# EAGLE design BrewBoard (EAGLE 9.6.2)
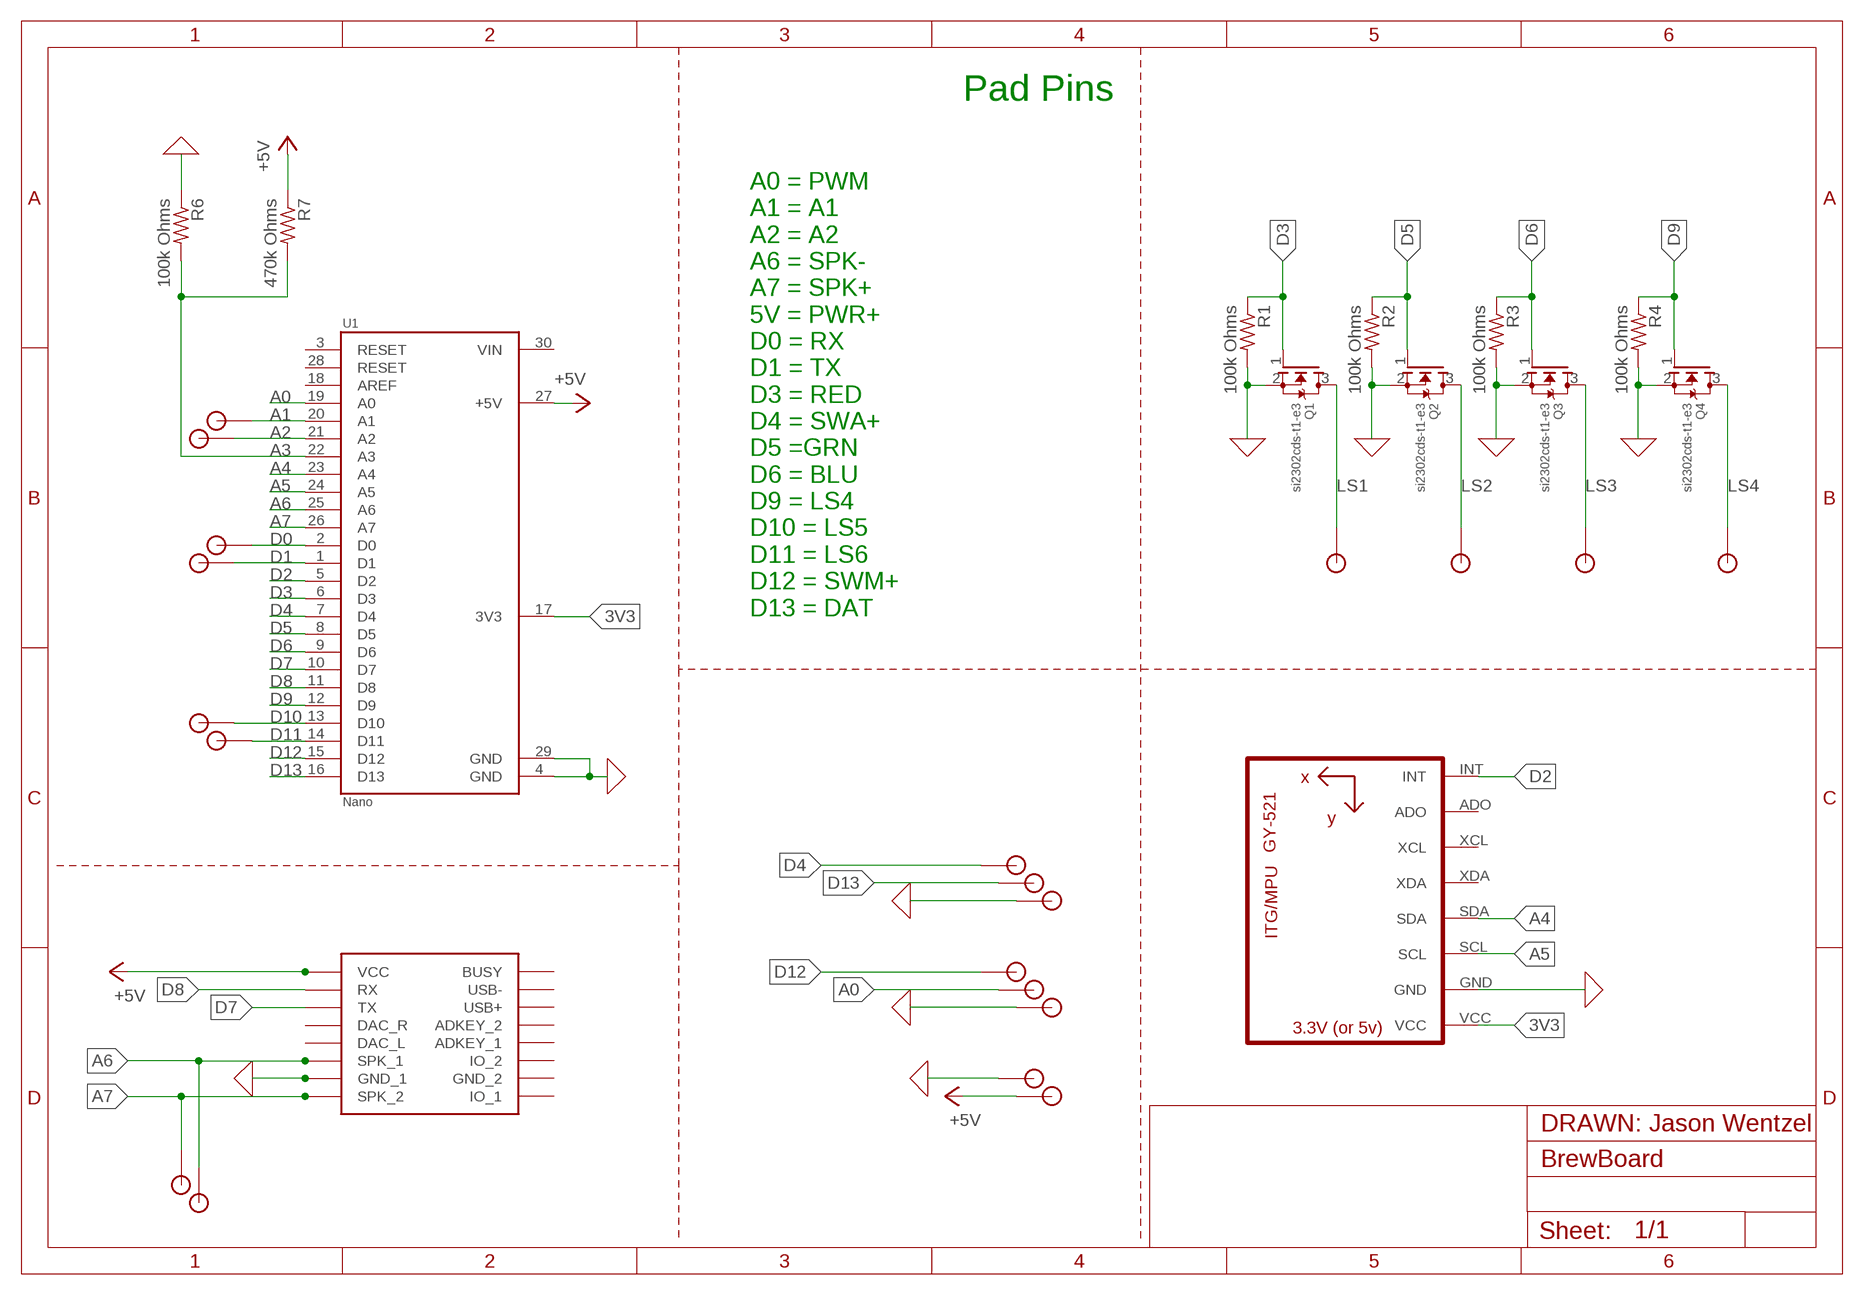
[diagram p0: schematic, sheet 1]

## Parts
LS1  SINGLE_ONE_SIDE_PAD  [SOS_PAD]
Q1  si2302cds-t1-e3  MOSFET-NREFLOW  [SOT23]
Q2  si2302cds-t1-e3  MOSFET-NREFLOW  [SOT23]
Q3  si2302cds-t1-e3  MOSFET-NREFLOW  [SOT23]
Q4  si2302cds-t1-e3  MOSFET-NREFLOW  [SOT23]
R1  100k Ohms  R-US_R0805  [R0805]
R2  100k Ohms  R-US_R0805  [R0805]
R3  100k Ohms  R-US_R0805  [R0805]
R4  100k Ohms  R-US_R0805  [R0805]
R6  100k Ohms  R-US_R0805  [R0805]
R7  470k Ohms  R-US_R0805  [R0805]
SPK+  SINGLE_ONE_SIDE_PAD  [SOS_PAD]
U1  Nano  A000005NANO_SLIM  [ARDUINO_NANO_OUT]
U2  GY-521MPU6050  [GY-521]
U3  DFPLAYER  [DFPLAYER]
U$1  SINGLE_ONE_SIDE_PAD  [SOS_PAD]
U$4  SINGLE_ONE_SIDE_PAD  [SOS_PAD]
U$5  SINGLE_ONE_SIDE_PAD  [SOS_PAD]
U$6  SINGLE_ONE_SIDE_PAD  [SOS_PAD]
U$7  SINGLE_ONE_SIDE_PAD  [SOS_PAD]
U$8  SINGLE_ONE_SIDE_PAD  [SOS_PAD]
U$9  SINGLE_ONE_SIDE_PAD  [SOS_PAD]
U$11  SINGLE_ONE_SIDE_PAD  [SOS_PAD]
U$12  SINGLE_ONE_SIDE_PAD  [SOS_PAD]
U$13  SINGLE_ONE_SIDE_PAD  [SOS_PAD]
U$15  SINGLE_ONE_SIDE_PAD  [SOS_PAD]
U$16  SINGLE_ONE_SIDE_PAD  [SOS_PAD]
U$17  SINGLE_ONE_SIDE_PAD  [SOS_PAD]
U$18  SINGLE_ONE_SIDE_PAD  [SOS_PAD]
U$19  SINGLE_ONE_SIDE_PAD  [SOS_PAD]
U$22  SINGLE_ONE_SIDE_PAD  [SOS_PAD]
U$27  SINGLE_ONE_SIDE_PAD  [SOS_PAD]
U$28  SINGLE_ONE_SIDE_PAD  [SOS_PAD]

## Nets
0: Q1.2(S) Q2.2(S) Q3.2(S) Q4.2(S) R1.2 R2.2 R3.2 R4.2 R6.1 U1.4(GND) U1.29(GND) U2.GND U3.GND_1 U$13.P$1 U$17.P$1 U$27.P$1 ; supply symbol labelled GND
3V3: U1.17(3V3) U2.VCC
+5V: R7.1 U1.27(+5V) U3.VCC U$12.P$1
A0: U1.19(A0) U$18.P$1
A1: U1.20(A1) U$1.P$1
A2: U1.21(A2) U$4.P$1
A3: R6.2 R7.2 U1.22(A3)
A4: U1.23(A4) U2.SDA
A5: U1.24(A5) U2.SCL
A6: U1.25(A6) U3.SPK1(SPK_1) U$11.P$1
A7: SPK+.P$1 U1.26(A7) U3.SPK2(SPK_2)
D0: U1.2(D0) U$5.P$1
D1: U1.1(D1) U$6.P$1
D2: U1.5(D2) U2.INT
D3: Q1.1(G) R1.1 U1.6(D3)
D4: U1.7(D4) U$22.P$1
D5: Q2.1(G) R2.1 U1.8(D5)
D6: Q3.1(G) R3.1 U1.9(D6)
D7: U1.10(D7) U3.TX
D8: U1.11(D8) U3.RX
D9: Q4.1(G) R4.1 U1.12(D9)
D10: U1.13(D10) U$8.P$1
D11: U1.14(D11) U$9.P$1
D12: U1.15(D12) U$19.P$1
D13: U1.16(D13) U$28.P$1
LS1: LS1.P$1 Q1.3(D)
LS2: Q2.3(D) U$15.P$1
LS3: Q3.3(D) U$16.P$1
LS4: Q4.3(D) U$7.P$1
Unconnected: U1.3(RESET) U1.18(AREF) U1.28(RESET) U2.ADO U2.XCL U2.XDA U3.ADKEY1(ADKEY_1) U3.ADKEY2(ADKEY_2) U3.BUSY U3.DAC_L U3.DAC_R U3.GND_2 U3.IO1(IO_1) U3.IO2(IO_2) U3.USB+ U3.USB-

## Notes on the sheet
- Nano | Pad Pins | MOSFETs
- A0 = PWM
  A1 = A1
  A2 = A2
  A6 = SPK-
  A7 = SPK+
  5V = PWR+
  D0 = RX
  D1 = TX
  D3 = RED
  D4 = SWA+
  D5 =GRN
  D6 = BLU
  D9 = LS4
  D10 = LS5
  D11 = LS6
  D12 = SWM+
  D13 = DAT
- Pads | MPU6050
- DFPlayer
- DRAWN: Jason Wentzel

## Power pins joined to a net without a drawn wire
VIN: U1.30(VIN)

## Library data of the parts
LS1 SPK+ U$1 U$4-U$9 U$11-U$13 U$15-U$19 U$22 U$27 U$28 = BrewboardV4:SINGLE_ONE_SIDE_PAD: Small Pad to replace thought hole pads
Q1-Q4 = BrewBoard:MOSFET-N: N-Channel Mosfet 2N7002E - 60V 260mA SOT23 [Digikey: 2N7002ET1GOSTR-ND] - REEL BSH103 - 30V 850mA SOT23 [Digikey: 568-5013-1-ND]
R1-R4 R6 R7 = BrewBoard:R-US_: RESISTOR, American symbol
U1 = BrewBoard:A000005: MICRO, ARDUINO NANO 3.0, MINI-B USB, ATmega328, 0.1"DIP, ICSP HDR
U2 = BrewBoard:GY-521
U3 = BrewBoard:DFPLAYER

## Board
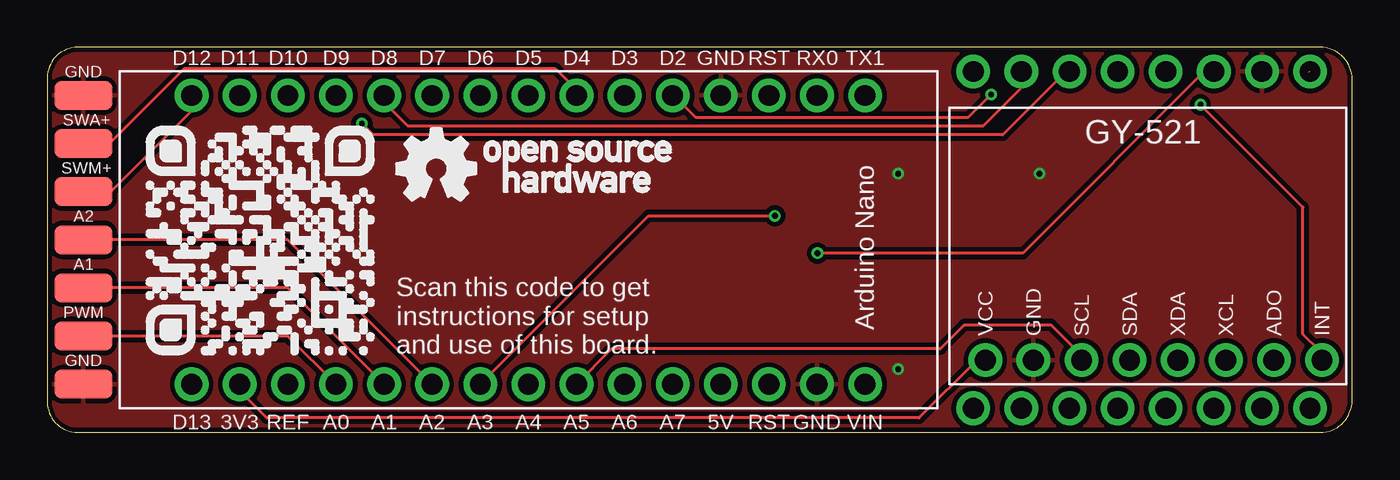
[diagram p1: board, top side]
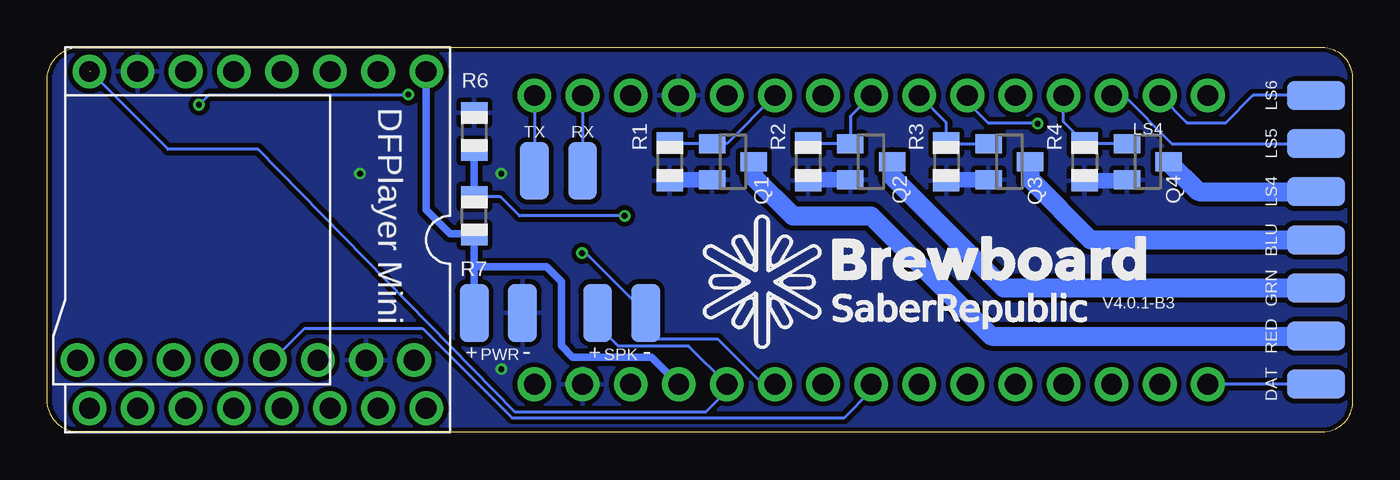
[diagram p2: board, bottom side, seen from below]

Size 68.9 x 20.32 mm. Coordinates in mm from the lower left corner, seen from the top.
Outline: 0,18.73 0,1.59 arc90 1.59,0 67.22,0 arc90 68.9,1.68 68.9,18.64 arc90 67.22,20.32 1.59,20.32 arc90 0,18.73
Copper layers (1*16): Top 0.035mm / dielectric 1.5mm / Bottom 0.035mm
Design rules "Seeed Fusion Design Rules": minimum track width 6mil, minimum drill 12mil, track to track 6mil, track to pad 6mil, pad to pad 6mil, via to via 6mil, smd to smd 0mil, copper to edge 10mil, drill to drill 10mil, minimum pad ring 10mil, minimum via ring 6mil, stop-mask expansion 2mil, vias tented up to drill 100mil, thermal gap 10mil

### Footprints (pad centres in the part's own frame; a part is rotated, then mirrored left to right if it is on the bottom)
SOS_PAD = smd 3.048 x 1.524: P$1 0,0
SOT23 = smd 1 x 1.4: 1 -0.95,-1.1; 2 0.95,-1.1; 3 0,1.1
R0805 = smd 1.1 x 1.4: 1 -1,0; 2 1,0
ARDUINO_NANO_OUT = drill 1.1 pad 1.778: 1 -7.62,17.78; 2 -7.62,15.24; 3 -7.62,12.7; 4 -7.62,10.16; 5 -7.62,7.62; 6 -7.62,5.08; 7 -7.62,2.54; 8 -7.62,0; 9 -7.62,-2.54; 10 -7.62,-5.08; 11 -7.62,-7.62; 12 -7.62,-10.16; 13 -7.62,-12.7; 14 -7.62,-15.24; 15 -7.62,-17.78; 16 7.62,-17.78; 17 7.62,-15.24; 18 7.62,-12.7; 19 7.62,-10.16; 20 7.62,-7.62; 21 7.62,-5.08; 22 7.62,-2.54; 23 7.62,0; 24 7.62,2.54; 25 7.62,5.08; 26 7.62,7.62; 27 7.62,10.16; 28 7.62,12.7; 29 7.62,15.24; 30 7.62,17.78
GY-521 = drill 1.1 pad 1.778: ADO -8.89,-6.35; GND -8.89,6.35; INT -8.89,-8.89; SCL -8.89,3.81; SDA -8.89,1.27; VCC -8.89,8.89; XCL -8.89,-3.81; XDA -8.89,-1.27
DFPLAYER = drill 1.1 pad 1.778: ADKEY1 8.89,-1.27; ADKEY2 8.89,1.27; BUSY 8.89,8.89; DAC_L -8.89,-1.27; DAC_R -8.89,1.27; GND_1 -8.89,-6.35; GND_2 8.89,-6.35; IO1 8.89,-8.89; IO2 8.89,-3.81; RX -8.89,6.35; SPK1 -8.89,-3.81; SPK2 -8.89,-8.89; TX -8.89,3.81; USB+ 8.89,3.81; USB- 8.89,6.35; VCC -8.89,8.89

### Placement (x,y rotation side)
LS1  1.91,5.08 0 bottom
Q1  32.7,14.29 270 bottom
Q2  25.4,14.29 270 bottom
Q3  18.1,14.29 270 bottom
Q4  10.79,14.29 270 bottom
R1  36.04,14.29 270 bottom
R2  28.73,14.29 270 bottom
R3  21.43,14.29 270 bottom
R4  14.13,14.29 270 bottom
R6  46.35,15.88 270 bottom
R7  46.35,11.43 90 bottom
SPK+  39.85,6.3 90 bottom
U1  25.4,10.16 270 top
U2  58.42,12.7 90 top
U3  57.78,10.16 270 bottom
U$1  1.91,7.62 0 top
U$2  [BREWBOARD_GOLDSTAR_SM]  10.95,4.45 0 top
U$3  [OSHW_FULL_TOP]  18.41,12.22 0 top
U$4  1.91,10.16 0 top
U$5  40.64,13.81 90 bottom
U$6  43.18,13.81 90 bottom
U$7  1.91,12.7 0 bottom
U$8  1.91,15.24 0 bottom
U$9  1.91,17.78 0 bottom
U$11  37.31,6.3 90 bottom
U$12  46.35,6.3 90 bottom
U$13  43.81,6.3 90 bottom
U$15  1.91,7.62 0 bottom
U$16  1.91,10.16 0 bottom
U$17  1.91,2.54 0 top
U$18  1.91,5.08 0 top
U$19  1.91,12.7 0 top
U$22  1.91,15.24 0 top
U$27  1.91,17.78 0 top
U$28  1.91,2.54 0 bottom
U$31  [BREWBOARD_QR_CODE]  5.24,4.13 0 top

### Tracks (layer width: path | path; a pad name or v marks a point on that pad's centre or on a via)
0  (via drill 0.3)
  Bottom 0.152: 26.5,13.37 Q2.2 | 28.63,13.37 R2.2
  Bottom 0.406: Q2.2 26.77,13.61
  Bottom 0.508: 21.38,13.34 R3.2 | 28.68,13.34 R2.2 | 35.99,13.34 R1.2
  Bottom 0.813: Q3.2 21.38,13.34 | Q2.2 28.68,13.34 | Q1.2 35.99,13.34 | Q4.2 11.95,13.29 R4.2
  other vias: 44.93,3.33 52.39,13.65 44.93,13.65
  pour Top (isolate 0.254): 0,-0.16 0,20.48 69.22,20.48 69.22,-0.16
  pour Bottom (isolate 0.254): 0,-0.16 69.22,-0.16 69.22,20.48 0,20.48
3V3
  Top 0.152: U2.VCC 49.07,3.81 46.02,0.76 11.58,0.76 10.16,2.18 U1.17
+5V
  Bottom 0.152: 46.33,10.36 R7.1
  Bottom 0.305: 46.35,10.34 46.33,10.36 | R7.1 46.4,10.48
  Bottom 0.406: U1.27 36.99,3.97 41.16,3.97 41.75,4.56 41.75,7.94 42.55,8.73 46.35,8.73 | 46.35,6.94 U$12.P$1 46.35,8.73 | 46.4,10.48 47.62,10.48 48.9,11.75 U3.VCC | 46.35,10.34 46.35,8.73
A0
  Top 0.152: U1.19 12.7,5.08 U$18.P$1
A1
  Top 0.152: U1.20 12.7,7.62 U$1.P$1
  Bottom 0.152: 18.1,2.54 U1.20
A2
  Top 0.152: U1.21 12.7,10.16 U$4.P$1
  Bottom 0.152: U1.21 20.48,2.54
A3  (via drill 0.3)
  Top 0.152: U1.22 31.75,11.43 v38.42,11.43
  Bottom 0.152: 46.33,14.78 R6.2 | v38.42,11.43 43.97,11.43 44.97,12.43 R7.2
  Bottom 0.406: R7.2 R6.2
A4
  Bottom 0.152: U2.SDA 57,3.81 55.32,5.49 49.09,5.49 44.36,0.76 26.82,0.76 25.4,2.18 U1.23
A5
  Top 0.152: U2.SCL 54.56,3.81 54.56,4.12 53,5.67 48.42,5.67 47.15,4.4 29.8,4.4 U1.24
A6  (via drill 0.3)
  Top 0.152: U3.SPK1 61.1,19.05 51.51,9.46 v40.66,9.46
  Bottom 0.152: U1.25 31.11,2.54 33.5,4.92 37.31,4.92 U$11.P$1 40.46,9.46 v40.66,9.46
A7  (1 unrouted)
  Bottom 0.152: 66.61,19.02 62.52,14.94 57.76,14.94 44.21,1.07 34.14,1.07 33.02,2.18 U1.26 35.03,4.55 38.73,4.55 39.85,5.67 SPK+.P$1 39.33,6.3
D0
  Bottom 0.152: U1.2 U$5.P$1
D1
  Bottom 0.152: U1.1 U$6.P$1
D2  (via drill 0.3)
  Top 0.152: v49.84,17.83 48.62,16.61 34.26,16.61 33.19,17.68 33.07,17.68 U1.5 | v60.89,17.29 66.29,11.89 66.29,5.18 67.21,4.27 67.21,3.81 U2.INT
  Bottom 0.152: v49.84,17.83 60.35,17.83 v60.89,17.29
D3
  Bottom 0.152: R1.1 35.99,15.24 33.81,15.24 Q1.1 33.02,15.24 U1.6
D4
  Top 0.152: U1.7 27.94,18.09 26.84,19.19 7.23,19.19 3.28,15.24 U$22.P$1
D5
  Bottom 0.152: 28.25,14.88 R2.1 28.68,15.24 Q2.1 26.5,15.2 26.5,16.68 U1.8
D6
  Bottom 0.152: Q3.1 21.38,15.24 R3.1 21.43,16.35 U1.9
D7  (via drill 0.3)
  Top 0.152: v16.61,16.29 17.21,15.7 50.44,15.7 53.8,19.05 U3.TX
  Bottom 0.152: v16.61,16.29 16.62,16.31 19.2,16.31 20.32,17.42 U1.10
D8
  Top 0.152: U3.RX 51.36,19.05 51.36,18.12 49.4,16.16 19.04,16.16 17.78,17.42 U1.11
D9
  Bottom 0.152: 14.92,17.78 U1.12 15.24,16.4 R4.1 14.08,15.24 Q4.1
D10
  Bottom 0.152: U1.13 12.06,17.78 9.53,15.24 U$8.P$1
D11
  Bottom 0.152: U1.14 8.73,16.35 6.67,16.35 5.24,17.78 U$9.P$1
D12
  Top 0.152: U$19.P$1 3.33,12.7 7.62,16.99 U1.15
D13
  Bottom 0.152: U$28.P$1 U1.16
LS1
  Bottom 1.016: Q1.3 31.6,13.49 29.54,11.43 25.4,11.43 19.05,5.08 LS1.P$1
LS2
  Bottom 0.152: 24.22,14.29 Q2.3
  Bottom 1.016: Q2.3 24.29,13.49 18.41,7.62 U$15.P$1
LS3
  Bottom 1.016: Q3.3 17,13.35 13.81,10.16 U$16.P$1
LS4
  Bottom 1.016: Q4.3 8.11,12.7 U$7.P$1

### Text on the board
tNames: GND | SWA+ | SWM+ | A2 | A1 | PWM | Arduino Nano | Scan this code to get / instructions for setup / and use of this board. | GND
bNames: LS6 | LS4 | RX | TX | LS5 | LS4 | BLU | GRN | V4.0.1-B3 | RED | - | SPK | + | - | PWR | + | DAT